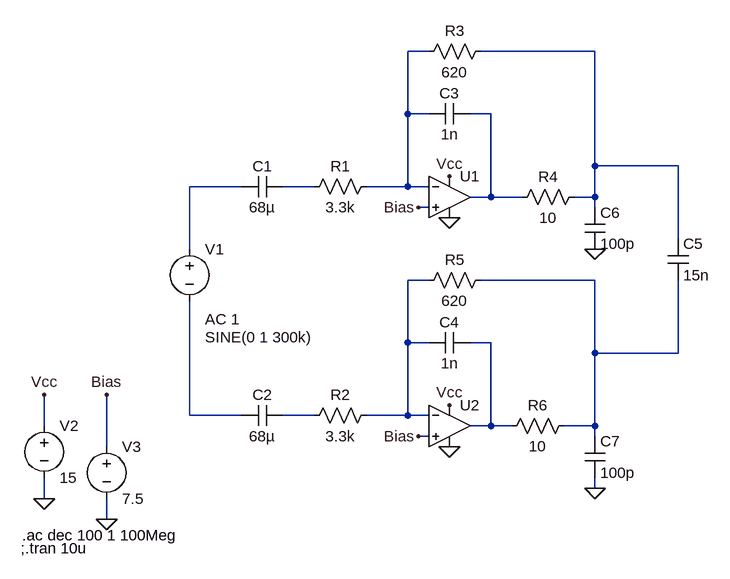
[diagram p0: schematic ak55x8 example frontend.asc]
ak55x8 example frontend.asc, the LTspice schematic file:
Version 4
SHEET 1 880 680
WIRE 384 -224 352 -224
WIRE 640 -224 464 -224
WIRE 352 -128 352 -224
WIRE 384 -128 352 -128
WIRE 480 -128 448 -128
WIRE 640 -48 640 -224
WIRE 768 -48 640 -48
WIRE 96 -16 16 -16
WIRE 208 -16 160 -16
WIRE 352 -16 352 -128
WIRE 352 -16 288 -16
WIRE 384 -16 352 -16
WIRE 480 0 480 -128
WIRE 480 0 448 0
WIRE 528 0 480 0
WIRE 640 0 640 -48
WIRE 640 0 608 0
WIRE 384 16 368 16
WIRE 640 16 640 0
WIRE 768 64 768 -48
WIRE 16 80 16 -16
WIRE 384 128 352 128
WIRE 640 128 464 128
WIRE 352 224 352 128
WIRE 384 224 352 224
WIRE 480 224 448 224
WIRE 640 240 640 128
WIRE 768 240 768 128
WIRE 768 240 640 240
WIRE 16 336 16 160
WIRE 96 336 16 336
WIRE 208 336 160 336
WIRE 352 336 352 224
WIRE 352 336 288 336
WIRE 384 336 352 336
WIRE -208 352 -208 304
WIRE 480 352 480 224
WIRE 480 352 448 352
WIRE 512 352 480 352
WIRE 640 352 640 240
WIRE 640 352 592 352
WIRE 384 368 368 368
WIRE 640 368 640 352
WIRE -112 384 -112 304
WIRE 640 448 640 432
WIRE -208 464 -208 432
WIRE -112 496 -112 464
FLAG 640 80 0
FLAG 640 448 0
FLAG 368 16 Bias
FLAG 368 368 Bias
FLAG 416 32 0
FLAG 416 384 0
FLAG 416 320 Vcc
FLAG 416 -32 Vcc
FLAG -112 496 0
FLAG -208 464 0
FLAG -112 304 Bias
FLAG -208 304 Vcc
SYMBOL voltage 16 64 R0
WINDOW 3 24 152 Left 2
WINDOW 123 24 124 Left 2
WINDOW 39 0 0 Left 2
SYMATTR InstName V1
SYMATTR Value SINE(0 1 300k)
SYMATTR Value2 AC 1
SYMBOL cap 160 -32 R90
WINDOW 0 0 32 VBottom 2
WINDOW 3 32 32 VTop 2
SYMATTR InstName C1
SYMATTR Value 68µ
SYMBOL cap 160 320 R90
WINDOW 0 0 32 VBottom 2
WINDOW 3 32 32 VTop 2
SYMATTR InstName C2
SYMATTR Value 68µ
SYMBOL res 304 -32 R90
WINDOW 0 0 56 VBottom 2
WINDOW 3 32 56 VTop 2
SYMATTR InstName R1
SYMATTR Value 3.3k
SYMBOL res 304 320 R90
WINDOW 0 0 56 VBottom 2
WINDOW 3 32 56 VTop 2
SYMATTR InstName R2
SYMATTR Value 3.3k
SYMBOL Opamps\\UniversalOpamp2 416 0 R0
SYMATTR InstName U1
SYMBOL res 480 -240 R90
WINDOW 0 0 56 VBottom 2
WINDOW 3 32 56 VTop 2
SYMATTR InstName R3
SYMATTR Value 620
SYMBOL res 624 -16 R90
WINDOW 0 0 56 VBottom 2
WINDOW 3 32 56 VTop 2
SYMATTR InstName R4
SYMATTR Value 10
SYMBOL cap 448 -144 R90
WINDOW 0 0 32 VBottom 2
WINDOW 3 32 32 VTop 2
SYMATTR InstName C3
SYMATTR Value 1n
SYMBOL res 480 112 R90
WINDOW 0 0 56 VBottom 2
WINDOW 3 32 56 VTop 2
SYMATTR InstName R5
SYMATTR Value 620
SYMBOL cap 448 208 R90
WINDOW 0 0 32 VBottom 2
WINDOW 3 32 32 VTop 2
SYMATTR InstName C4
SYMATTR Value 1n
SYMBOL Opamps\\UniversalOpamp2 416 352 R0
SYMATTR InstName U2
SYMBOL res 608 336 R90
WINDOW 0 0 56 VBottom 2
WINDOW 3 32 56 VTop 2
SYMATTR InstName R6
SYMATTR Value 10
SYMBOL cap 752 64 R0
SYMATTR InstName C5
SYMATTR Value 15n
SYMBOL cap 624 16 R0
SYMATTR InstName C6
SYMATTR Value 100p
SYMBOL cap 624 368 R0
SYMATTR InstName C7
SYMATTR Value 100p
SYMBOL voltage -208 336 R0
WINDOW 123 0 0 Left 2
WINDOW 39 0 0 Left 2
SYMATTR InstName V2
SYMATTR Value 15
SYMBOL voltage -112 368 R0
WINDOW 123 0 0 Left 2
WINDOW 39 0 0 Left 2
SYMATTR InstName V3
SYMATTR Value 7.5
TEXT -242 520 Left 2 !.ac dec 100 1 100Meg
TEXT -244 540 Left 2 !;.tran 10u

The netlist it stands for:
* ak55x8 example frontend.asc
V1 N004 N009 SINE(0 1 300k) AC 1
C1 N005 N004 68µ
C2 N010 N009 68µ
R1 N001 N005 3.3k
R2 N006 N010 3.3k
XU1 Bias N001 Vcc 0 N003 level.2 Avol=1Meg GBW=10Meg Slew=10Meg ilimit=25m rail=0 Vos=0 phimargin=45 en=0 enk=0 in=0 ink=0 Rin=500Meg  ; pins IN+ IN- V+ V- OUT
R3 N002 N001 620
R4 N002 N003 10
C3 N003 N001 1n
R5 N007 N006 620
C4 N008 N006 1n
XU2 Bias N006 Vcc 0 N008 level.2 Avol=1Meg GBW=10Meg Slew=10Meg ilimit=25m rail=0 Vos=0 phimargin=45 en=0 enk=0 in=0 ink=0 Rin=500Meg  ; pins IN+ IN- V+ V- OUT
R6 N007 N008 10
C5 N002 N007 15n
C6 N002 0 100p
C7 N007 0 100p
V2 Vcc 0 15
V3 Bias 0 7.5
.ac dec 100 1 100Meg
;.tran 10u
.lib UniversalOpamps2.sub
.backanno
.end